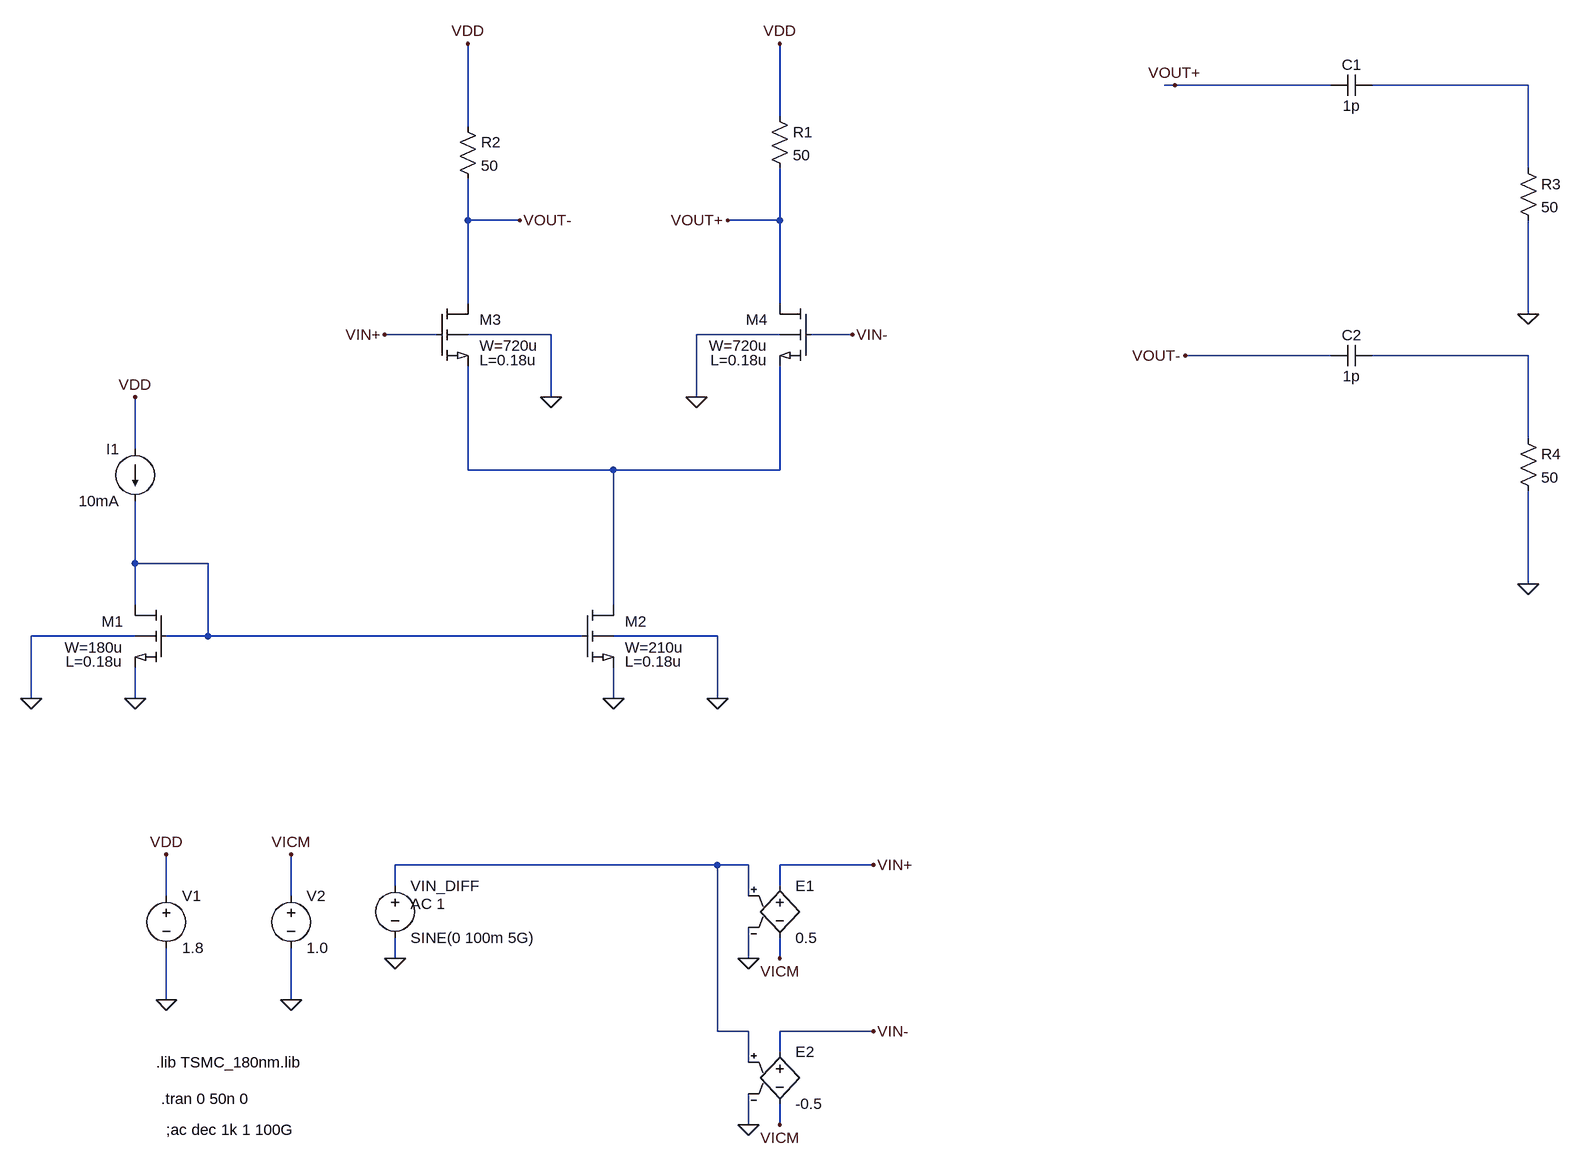
[diagram p0: schematic Diff_Amp.asc]
Diff_Amp.asc, the LTspice schematic file:
Version 4
SHEET 1 1488 944
WIRE 368 -1008 352 -1008
WIRE 608 -1008 368 -1008
WIRE 912 -1008 672 -1008
WIRE -240 -960 -240 -1072
WIRE -720 -944 -720 -1072
WIRE 912 -880 912 -1008
WIRE -720 -800 -720 -864
WIRE -640 -800 -720 -800
WIRE -240 -800 -240 -880
WIRE -240 -800 -320 -800
WIRE -720 -672 -720 -800
WIRE -240 -672 -240 -800
WIRE 912 -656 912 -800
WIRE -768 -624 -848 -624
WIRE -592 -624 -720 -624
WIRE -240 -624 -368 -624
WIRE -128 -624 -192 -624
WIRE 608 -592 384 -592
WIRE 912 -592 672 -592
WIRE -592 -528 -592 -624
WIRE -368 -528 -368 -624
WIRE 912 -464 912 -592
WIRE -1232 -448 -1232 -528
WIRE -720 -416 -720 -576
WIRE -496 -416 -720 -416
WIRE -240 -416 -240 -576
WIRE -240 -416 -496 -416
WIRE -1232 -272 -1232 -368
WIRE -1120 -272 -1232 -272
WIRE 912 -240 912 -384
WIRE -1232 -208 -1232 -272
WIRE -496 -208 -496 -416
WIRE -1232 -160 -1392 -160
WIRE -1120 -160 -1120 -272
WIRE -1120 -160 -1184 -160
WIRE -544 -160 -1120 -160
WIRE -336 -160 -496 -160
WIRE -1392 -64 -1392 -160
WIRE -1232 -64 -1232 -112
WIRE -496 -64 -496 -112
WIRE -336 -64 -336 -160
WIRE -336 192 -832 192
WIRE -288 192 -336 192
WIRE -96 192 -240 192
WIRE -832 224 -832 192
WIRE -240 224 -240 192
WIRE -1184 240 -1184 176
WIRE -992 240 -992 176
WIRE -288 240 -288 192
WIRE -832 336 -832 304
WIRE -288 336 -288 288
WIRE -240 336 -240 304
WIRE -1184 400 -1184 320
WIRE -992 400 -992 320
WIRE -336 448 -336 192
WIRE -288 448 -336 448
WIRE -96 448 -240 448
WIRE -240 480 -240 448
WIRE -288 496 -288 448
WIRE -288 592 -288 544
WIRE -240 592 -240 560
FLAG -1232 -64 0
FLAG -1392 -64 0
FLAG -1232 -528 VDD
FLAG -496 -64 0
FLAG -336 -64 0
FLAG -592 -528 0
FLAG -368 -528 0
FLAG -720 -1072 VDD
FLAG -240 -1072 VDD
FLAG -848 -624 VIN+
FLAG -128 -624 VIN-
FLAG -640 -800 VOUT-
FLAG -320 -800 VOUT+
FLAG -1184 400 0
FLAG -1184 176 VDD
FLAG -992 400 0
FLAG -992 176 VICM
FLAG -832 336 0
FLAG -288 336 0
FLAG -96 192 VIN+
FLAG -240 336 VICM
FLAG -288 592 0
FLAG -96 448 VIN-
FLAG -240 592 VICM
FLAG 912 -656 0
FLAG 912 -240 0
FLAG 368 -1008 VOUT+
FLAG 384 -592 VOUT-
SYMBOL nmos_180 -1184 -208 M0
SYMATTR InstName M1
SYMATTR Value2 W=180u
SYMBOL current -1232 -448 M0
WINDOW 123 0 0 Left 0
WINDOW 39 0 0 Left 0
SYMATTR InstName I1
SYMATTR Value 10mA
SYMBOL nmos_180 -544 -208 R0
SYMATTR InstName M2
SYMATTR Value2 W=210u
SYMBOL nmos_180 -768 -672 R0
SYMATTR InstName M3
SYMATTR Value2 W=720u
SYMBOL nmos_180 -192 -672 M0
SYMATTR InstName M4
SYMATTR Value2 W=720u
SYMBOL res -256 -976 R0
SYMATTR InstName R1
SYMATTR Value 50
SYMBOL res -736 -960 R0
SYMATTR InstName R2
SYMATTR Value 50
SYMBOL voltage -1184 224 R0
WINDOW 123 0 0 Left 0
WINDOW 39 0 0 Left 0
SYMATTR InstName V1
SYMATTR Value 1.8
SYMBOL voltage -992 224 R0
WINDOW 123 0 0 Left 0
WINDOW 39 0 0 Left 0
SYMATTR InstName V2
SYMATTR Value 1.0
SYMBOL e -240 208 R0
SYMATTR InstName E1
SYMATTR Value 0.5
SYMBOL voltage -832 208 R0
WINDOW 123 24 44 Left 2
WINDOW 39 0 0 Left 0
SYMATTR InstName VIN_DIFF
SYMATTR Value SINE(0 100m 5G)
SYMATTR Value2 AC 1
SYMBOL e -240 464 R0
SYMATTR InstName E2
SYMATTR Value -0.5
SYMBOL cap 672 -1024 R90
WINDOW 0 0 32 VBottom 2
WINDOW 3 32 32 VTop 2
SYMATTR InstName C1
SYMATTR Value 1p
SYMBOL res 896 -896 R0
SYMATTR InstName R3
SYMATTR Value 50
SYMBOL cap 672 -608 R90
WINDOW 0 0 32 VBottom 2
WINDOW 3 32 32 VTop 2
SYMATTR InstName C2
SYMATTR Value 1p
SYMBOL res 896 -480 R0
SYMATTR InstName R4
SYMATTR Value 50
TEXT -1200 496 Left 2 !.lib TSMC_180nm.lib
TEXT -1192 552 Left 2 !.tran 0 50n 0
TEXT -1184 600 Left 2 !;ac dec 1k 1 100G

The netlist it stands for:
* Diff_Amp.asc
M1 N004 N004 0 0 NMOS_TSMC_180nm W=180u L=0.18u
I1 VDD N004 10mA
M2 N003 N004 0 0 NMOS_TSMC_180nm W=210u L=0.18u
M3 VOUT- VIN+ N003 0 NMOS_TSMC_180nm W=720u L=0.18u
M4 VOUT+ VIN- N003 0 NMOS_TSMC_180nm W=720u L=0.18u
R1 VDD VOUT+ 50
R2 VDD VOUT- 50
V1 VDD 0 1.8
V2 VICM 0 1.0
E1 VIN+ VICM N005 0 0.5
VIN_DIFF N005 0 SINE(0 100m 5G) AC 1
E2 VIN- VICM N005 0 -0.5
C1 N001 VOUT+ 1p
R3 N001 0 50
C2 N002 VOUT- 1p
R4 N002 0 50
.model NMOS NMOS
.model PMOS PMOS
.lib standard.mos
.lib TSMC_180nm.lib
.tran 0 50n 0
;ac dec 1k 1 100G
.backanno
.end